# EasyEDA Pro project 2.4G遥控器.epro

# Schematic Schematic1
Board Name: Board1; Create Date: 2024-08-30
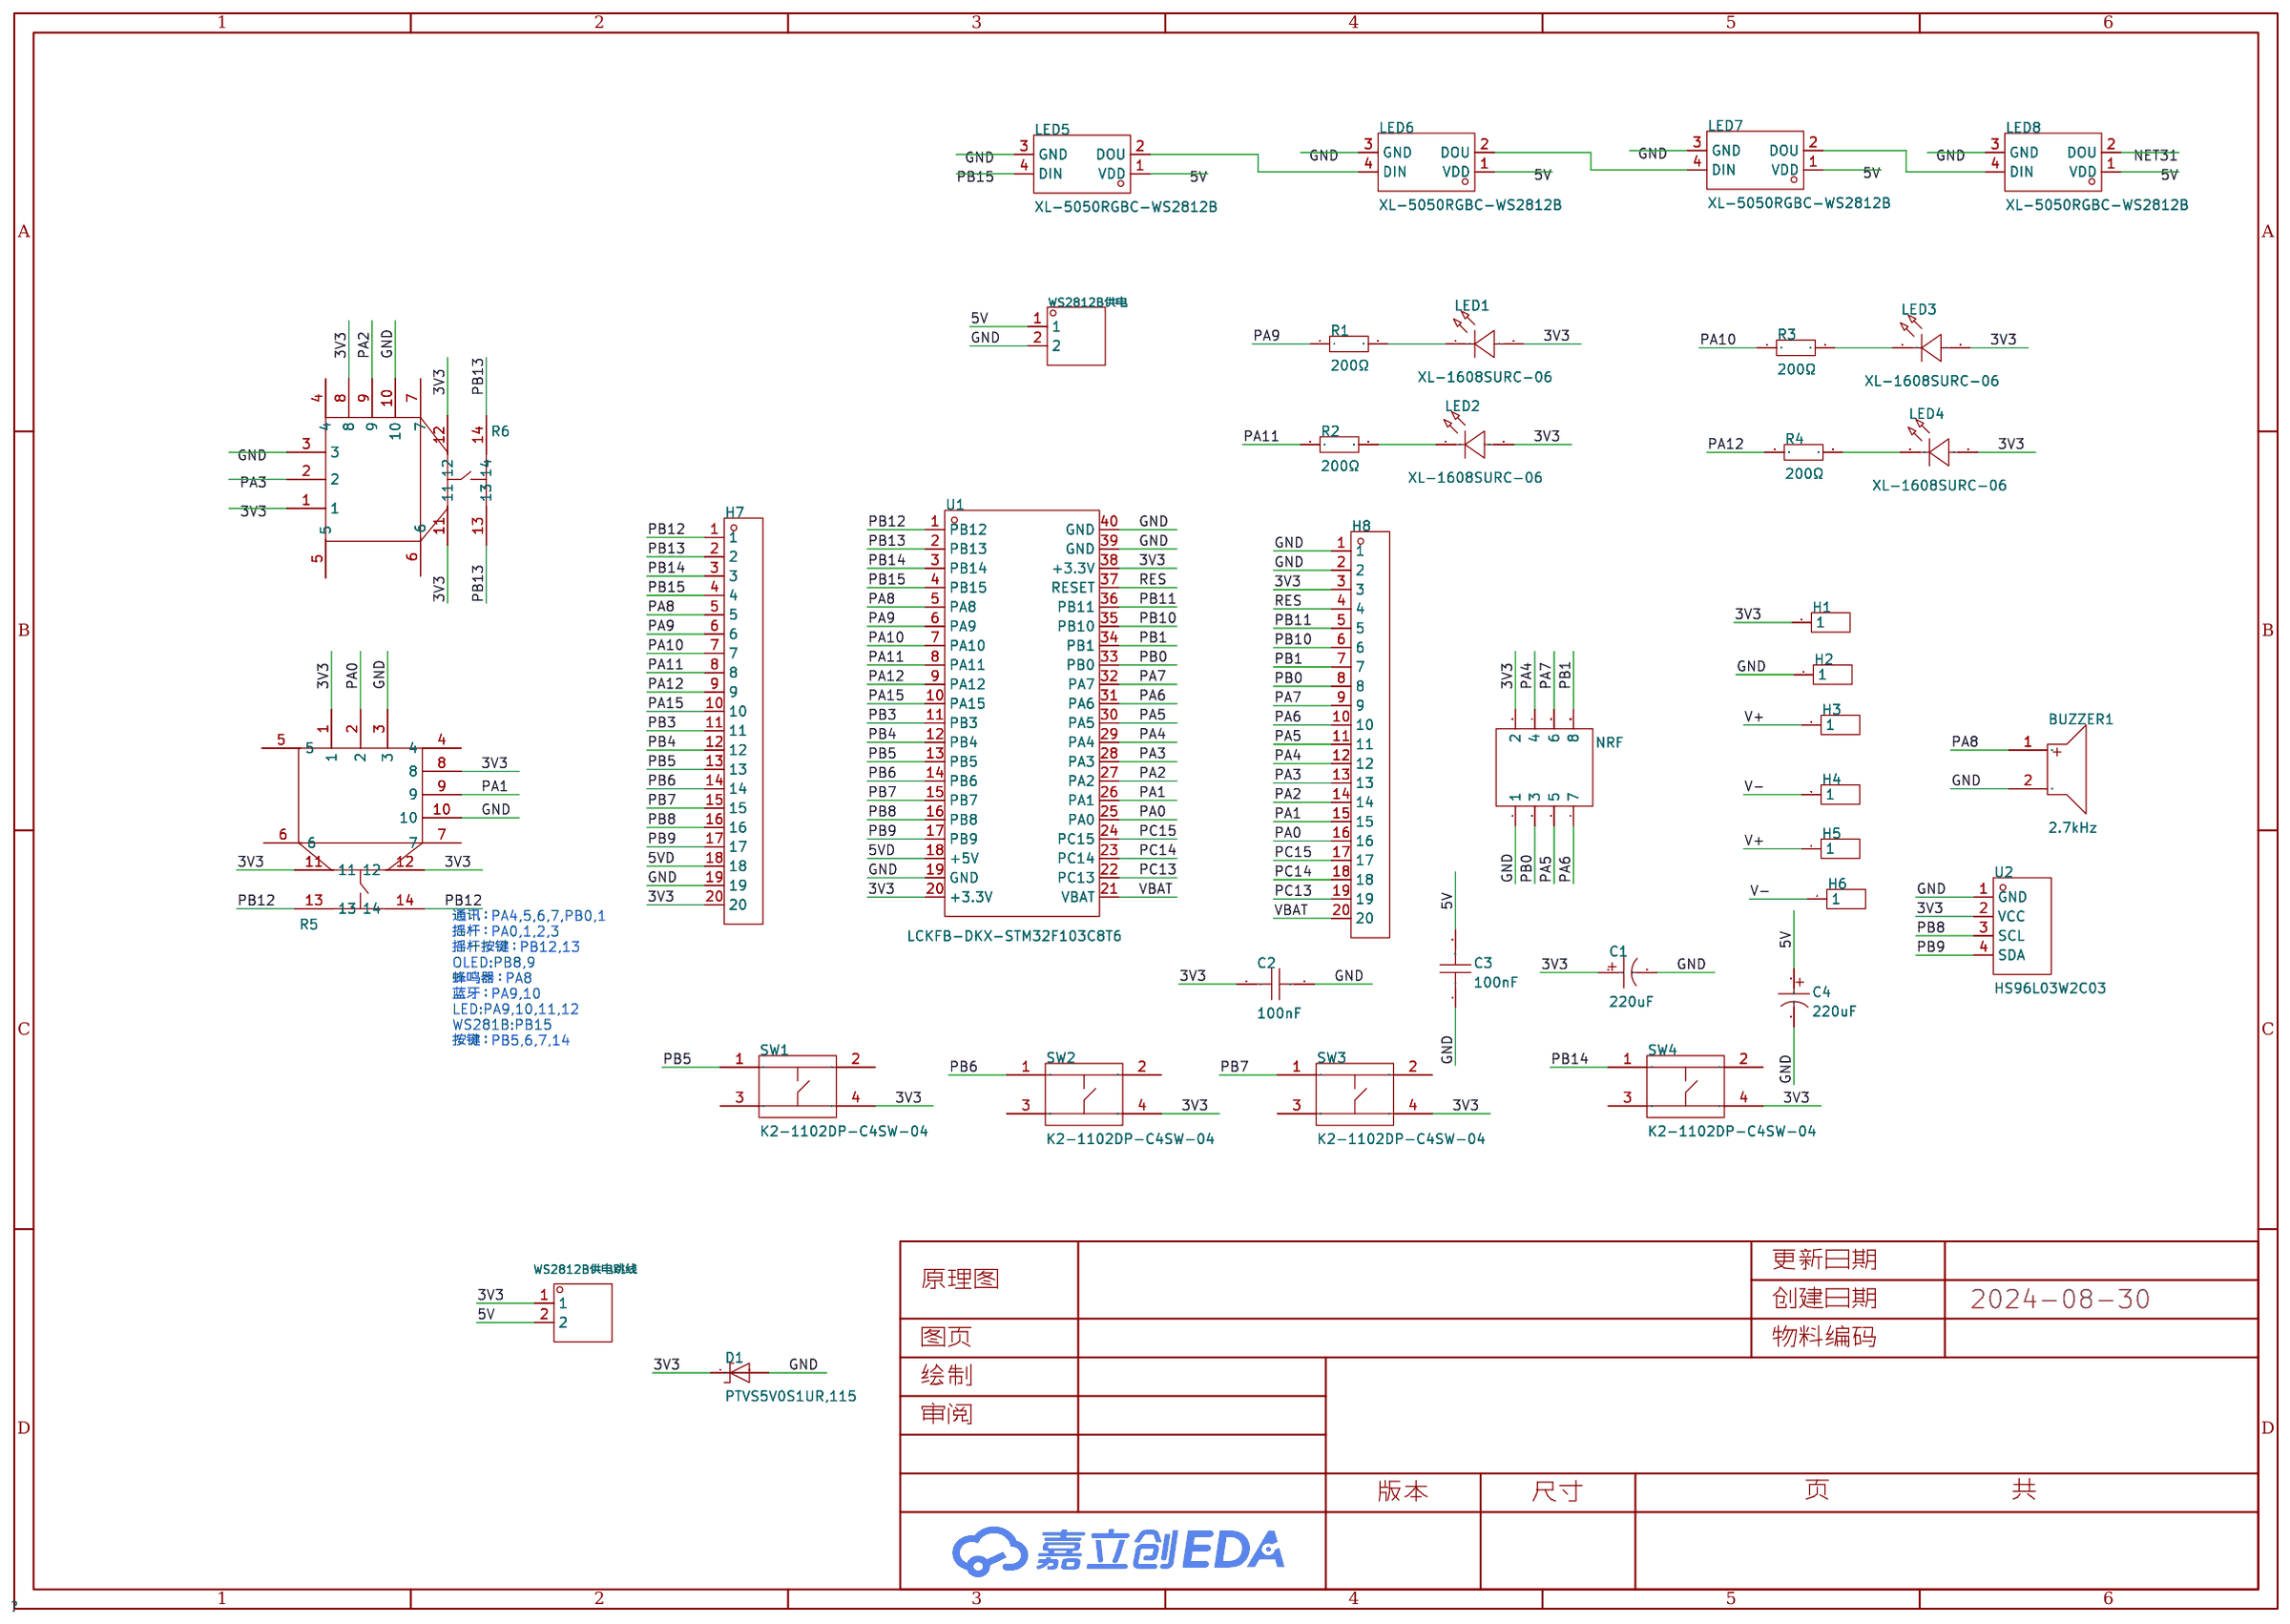
[diagram p0: schematic sheet]

## Parts
BUZZER1  2.7kHz  [BUZ-TH_BD9.0-P4.00-D0.6-FD]
C1  220uF  [CAP-TH_BD8.0-P3.50-D0.6-FD]
C2  100nF  [C0603]
C3  100nF  [C0603]
C4  220uF  [CAP-TH_BD8.0-P3.50-D0.6-FD]
D1  PTVS5V0S1UR,115  [SOD-123_L2.8-W1.8-LS3.7-RD]
H1  -  [HDR-TH_1P-V-M_XKB_X4611WV-01I-C28D40]
H2  -  [HDR-TH_1P-V-M_XKB_X4611WV-01I-C28D40]
H3  -  [HDR-TH_1P-V-M_XKB_X4611WV-01I-C28D40]
H4  -  [HDR-TH_1P-V-M_XKB_X4611WV-01I-C28D40]
H5  -  [HDR-TH_1P-V-M_XKB_X4611WV-01I-C28D40]
H6  -  [HDR-TH_1P-V-M_XKB_X4611WV-01I-C28D40]
H7  -  [HDR-TH_20P-P2.54-V-M-1]
H8  -  [HDR-TH_20P-P2.54-V-M-1]
LED1  XL-1608SURC-06  [LED0603-RD_RED]
LED2  XL-1608SURC-06  [LED0603-RD_RED]
LED3  XL-1608SURC-06  [LED0603-RD_RED]
LED4  XL-1608SURC-06  [LED0603-RD_RED]
LED5  XL-5050RGBC-WS2812B  [LED-SMD_4P-L5.0-W5.0-BL_XL-5050RGBC]
LED6  XL-5050RGBC-WS2812B  [LED-SMD_4P-L5.0-W5.0-BL_XL-5050RGBC]
LED7  XL-5050RGBC-WS2812B  [LED-SMD_4P-L5.0-W5.0-BL_XL-5050RGBC]
LED8  XL-5050RGBC-WS2812B  [LED-SMD_4P-L5.0-W5.0-BL_XL-5050RGBC]
NRF  -  [HDR-TH_8P-P2.54-V-F-R2-C4-S2.54-1]
R1  200Ω  [R0603]
R2  200Ω  [R0603]
R3  200Ω  [R0603]
R4  200Ω  [R0603]
R5  -  [摇杆]
R6  -  [摇杆]
SW1  K2-1102DP-C4SW-04  [KEY-TH_4P-L6.0-W6.0-P4.50-LS6.50]
SW2  K2-1102DP-C4SW-04  [KEY-TH_4P-L6.0-W6.0-P4.50-LS6.50]
SW3  K2-1102DP-C4SW-04  [KEY-TH_4P-L6.0-W6.0-P4.50-LS6.50]
SW4  K2-1102DP-C4SW-04  [KEY-TH_4P-L6.0-W6.0-P4.50-LS6.50]
U1  LCKFB-DKX-STM32F103C8T6  [CONN-TH_L53.3-W22.9_STM32F103C8T6-CARD]
U2  HS96L03W2C03  [OLED-TH_L27.8-W27.2-P2.54_C9900033791]
WS2812B供电  -  [HDR-TH_2P-P2.54-V-M-1]
WS2812B供电跳线  -  [HDR-TH_2P-P2.54-V-M-1]

## Library data of the parts
BUZZER1 = QMB-09B-03: 驱动方式:无源(外部驱动);构造类型:电磁式;频率:2.7kHz;声压(SPL):85dB@3V,10cm;; LCSC Part Name: 无源蜂鸣器QMB-09B-03; Supplier Part: C96256; Manufacturer: 华能; Supplier Footprint: 插件,D=9mm; JLCPCB Part Class: 扩展库; Datasheet: https://atta.szlcsc.com/upload/public/pdf/source/20210401/C96256_958B17753B5AD7CBFBCFFC7C095B4484.pdf; Supplier: LCSC; Oscillator Circuit: 无源(外部驱动); Technology Type: 电磁式; Operating Voltage: 2V~5V; Sound Pressure Level (SPL): 85dB@3V,10cm; Diameter (φD): 9mm; Height: 5.7mm
C1 C4 = ERS1VM221F12OT: 容值:220uF;精度:±20%;额定电压:35V;; LCSC Part Name: 220uF ±20% 35V; Supplier Part: C106697; Manufacturer: AISHI(艾华集团); Supplier Footprint: 插件,D8xL12mm; JLCPCB Part Class: 扩展库; Datasheet: https://atta.szlcsc.com/upload/public/pdf/source/20191015/C438940_4B8E60A742BB0AE40DDEF87A5C89089D.pdf; Supplier: LCSC; Tolerance: ±20%; Rated Voltage: 35V; Lead Spacing: 3.5mm; φD: 8mm; L: 12mm; Lifetime @ Temp: 7000hrs@105℃
C2 C3 = CGA0603X7R104K500JT: 容值:100nF;精度:±10%;额定电压:50V;材质(温度系数):X7R;; LCSC Part Name: 100nF ±10% 50V; Supplier Part: C6119867; Manufacturer: HRE(芯声); Supplier Footprint: 0603; JLCPCB Part Class: Extended Part; Supplier: LCSC; Tolerance: ±10%; Voltage Rated: 50V; Temperature Coefficient: X7R
D1 = PTVS5V0S1UR,115: 极性:单向;反向截止电压(Vrwm):5V;击穿电压(最小值):6.4V;峰值脉冲电流(Ipp)@10/1000μs:43.5A;最大钳位电压:9.2V;; LCSC Part Name: 单向 5V; Supplier Part: C478011; Manufacturer: Nexperia(安世); Supplier Footprint: SOD-123W; JLCPCB Part Class: Extended Part; Datasheet: https://atta.szlcsc.com/upload/public/pdf/source/20200102/C478011_F05D9968189F983388C839BB3EF367D6.pdf; Supplier: LCSC; Polarity: 单向; Reverse Stand-Off Voltage (Vrwm): 5V; Breakdown Voltage (Min): 6.4V; Peak Pulse Current (Ipp)@10/1000μs: 43.5A; Maximum Clamping Voltage: 9.2V
H1-H6 = HDR-M_2.54_1x1P: Supplier Part: C81276; Supplier Footprint: 插件; JLCPCB Part Class: Extended Part
H7 H8 = HDR-M_2.54_1x20P: 间距:2.54mm;总PIN位数:20;排数:1;插针结构:-;行距:-;安装类型:直插;圆针/方针:-;额定电流:-;额定电压:-;配合针长度:-;塑高:-;触头材质:黄铜;触头镀层:-;颜色:黑色;; Supplier Part: C50981; Supplier Footprint: 插件
LED1-LED4 = XL-1608SURC-06: 发光颜色:红色;功率:55mW;正向电流:25mA;主波长:617nm~621nm;透镜颜色:无色透明透镜;色温:-;发光角度:120°;载带方式:正贴;工作温度:-30℃~+85℃;; Supplier Part: C965799; Manufacturer: XINGLIGHT(成兴光); Supplier Footprint: 0603; JLCPCB Part Class: 扩展库; Datasheet: https://atta.szlcsc.com/upload/public/pdf/source/20221102/D860AFDD1CDB02C5A8064103A32707E2.pdf; Supplier: LCSC; Emitted Color: 红色; Power Dissipation: 55mW; Forward Current: 25mA; Dominant Wavelength: 617nm~621nm; Peak Wavelength: 623nm; Lens Color: 无色透明透镜; Viewing Angle: 120°; Mounting Sytle: 正贴; Operating Temperature: -30℃~+85℃
LED5-LED8 = XL-5050RGBC-WS2812B: 5050七彩幻彩透明贴片LED灯珠 5050 幻彩透明四脚 ws2812B 内置驱动IC; Supplier Part: C2843785; Manufacturer: XINGLIGHT(成兴光); Supplier Footprint: SMD5050; JLCPCB Part Class: 扩展库; Datasheet: https://atta.szlcsc.com/upload/public/pdf/source/20240412/E1004CAA80592E31D08BFE019083806F.pdf; Supplier: LCSC
NRF = HDR-F_2.54_2x4: Supplier Part: C92271; Supplier Footprint: 插件
R1-R4 = 0603WAF1002T5E: 电阻类型:厚膜电阻;阻值:10kΩ;精度:±1%;功率:100mW;最大工作电压:75V;温度系数:±100ppm/℃;; LCSC Part Name: 厚膜电阻 10kΩ ±1% 100mW; Supplier Part: C25804; Manufacturer: UNI-ROYAL(厚声); Supplier Footprint: 0603; JLCPCB Part Class: 基础库; Datasheet: https://atta.szlcsc.com/upload/public/pdf/source/20200306/C422600_1E6D84923E4A46A82E41ADD87F860B5C.pdf; Supplier: LCSC; Type: 厚膜电阻; Tolerance: ±1%; Power(Watts): 100mW; Overload Voltage (Max): 75V; Temperature Coefficient: ±100ppm/℃; Operating Temperature Range: -55℃~+155℃
R5 R6 = 摇杆
SW1-SW4 = K2-1102DP-C4SW-04: 电路结构:单刀单掷;按钮形状:圆形按钮;作用力:2.5N;安装方式:直插;开关长度:6mm;开关宽度:6mm;开关高度:5mm;触点电流:50mA;额定电压(DC):12V;绝缘电阻:100MΩ;带灯:-;机械寿命:10万次;; LCSC Part Name: 轻触按键开关6*6*5; Supplier Part: C110153; Manufacturer: 韩国韩荣; Supplier Footprint: 插件; JLCPCB Part Class: 扩展库; Datasheet: https://atta.szlcsc.com/upload/public/pdf/source/20210810/D0CD9D77408EACA829A5E533AC6E5B1E.pdf; Supplier: LCSC; Circuit: 单刀单掷; Actuator Style: 圆形按钮; Operating Force: 2.5N; Mounting Style: 直插; Switch Length: 6mm; Switch Width: 6mm; Switch Height: 5mm; Contact Current: 50mA; Voltage Rating (DC): 12V; Insulation Resistance: 100MΩ; Mechanical Life: 10万次; Operating Temperature: -25℃~+85℃
U1 = LCKFB-DKX-STM32F103C8T6: LCSC Part Name: 立创·地阔星-STM32F103C8T6开发板; Supplier Part: C22396880; Manufacturer: 立创开发板; Datasheet: https://atta.szlcsc.com/upload/public/pdf/source/20240801/7EEF69F7480DF7C6DA98696664D658D4.pdf; Supplier: LCSC
U2 = HS96L03W2C03: 主控芯片:SSD1315;接口类型:I2C;尺寸(inch):0.96;像素分辨率:128x64;; LCSC Part Name: 0.96寸OLED显示屏窄白光IIC; Supplier Part: C5248080; Manufacturer: HS(汉昇); JLCPCB Part Class: 扩展库; Datasheet: https://atta.szlcsc.com/upload/public/pdf/source/20230627/763D01F79A90007632F098068C7C8AD9.pdf; Supplier: LCSC; Main Control Chip: SSD1315; Interface Type: I2C; Size: 0.96; Pixel Resolution: 128x64; Operating Temperature: -40℃~+70℃
WS2812B供电 WS2812B供电跳线 = HDR-M_2.54_1x2P: Supplier Part: C124375; Supplier Footprint: 插件

## Nets
3V3: C1.1 C2.1 D1.1(C) H1.1 H7.20 H8.3 LED1.2(A) LED2.2(A) LED3.2(A) LED4.2(A) NRF.2 R5.1 R5.8 R5.11 R5.12 R6.1 R6.8 R6.11 R6.12 SW1.4 SW2.4 SW3.4 SW4.4 U1.20(+3.3V) U1.38(+3.3V) U2.2(VCC) WS2812B供电跳线.1
5V: C3.2 C4.1 LED5.1(VDD) LED6.1(VDD) LED7.1(VDD) LED8.1(VDD) WS2812B供电.1 WS2812B供电跳线.2
5VD: H7.18 U1.18(+5V)
GND: BUZZER1.2 C1.2 C2.2 C3.1 C4.2 D1.2(A) H2.1 H7.19 H8.1 H8.2 LED5.3(GND) LED6.3(GND) LED7.3(GND) LED8.3(GND) NRF.1 R5.3 R5.10 R6.3 R6.10 U1.19(GND) U1.39(GND) U1.40(GND) U2.1(GND) WS2812B供电.2
VBAT: H8.20 U1.21(VBAT)
NET31: LED8.2(DOU)
PA0: H8.16 R5.2 U1.25(PA0)
PA1: H8.15 R5.9 U1.26(PA1)
PA2: H8.14 R6.9 U1.27(PA2)
PA3: H8.13 R6.2 U1.28(PA3)
PA4: H8.12 NRF.4 U1.29(PA4)
PA5: H8.11 NRF.5 U1.30(PA5)
PA6: H8.10 NRF.7 U1.31(PA6)
PA7: H8.9 NRF.6 U1.32(PA7)
PA8: BUZZER1.1 H7.5 U1.5(PA8)
PA9: H7.6 R1.1 U1.6(PA9)
PA10: H7.7 R3.1 U1.7(PA10)
PA11: H7.8 R2.1 U1.8(PA11)
PA12: H7.9 R4.1 U1.9(PA12)
PA15: H7.10 U1.10(PA15)
PB0: H8.8 NRF.3 U1.33(PB0)
PB1: H8.7 NRF.8 U1.34(PB1)
PB3: H7.11 U1.11(PB3)
PB4: H7.12 U1.12(PB4)
PB5: H7.13 SW1.1 U1.13(PB5)
PB6: H7.14 SW2.1 U1.14(PB6)
PB7: H7.15 SW3.1 U1.15(PB7)
PB8: H7.16 U1.16(PB8) U2.3(SCL)
PB9: H7.17 U1.17(PB9) U2.4(SDA)
PB10: H8.6 U1.35(PB10)
PB11: H8.5 U1.36(PB11)
PB12: H7.1 R5.13 R5.14 U1.1(PB12)
PB13: H7.2 R6.13 R6.14 U1.2(PB13)
PB14: H7.3 SW4.1 U1.3(PB14)
PB15: H7.4 LED5.4(DIN) U1.4(PB15)
PC13: H8.19 U1.22(PC13)
PC14: H8.18 U1.23(PC14)
PC15: H8.17 U1.24(PC15)
RES: H8.4 U1.37(RESET)
V+: H3.1 H5.1
V-: H4.1 H6.1
$1N3608: LED5.2(DOU) LED6.4(DIN)
$1N3616: LED6.2(DOU) LED7.4(DIN)
$1N3624: LED7.2(DOU) LED8.4(DIN)
Net-(LED1-1): LED1.1(K) R1.2
Net-(LED2-1): LED2.1(K) R2.2
Net-(LED3-1): LED3.1(K) R3.2
Net-(LED4-1): LED4.1(K) R4.2

Not connected (* = marked no-connect by the designer): R5 4 5 6 7; R6 4 5 6 7; SW1 2 3; SW2 2 3; SW3 2 3; SW4 2 3

## Notes on the sheet
- 通讯：PA4,5,6,7,PB0,1
  摇杆：PA0,1,2,3
  摇杆按键：PB12,13
  OLED:PB8,9
  蜂鸣器：PA8
  蓝牙：PA9,10
  LED:PA9,10,11,12
  WS281B:PB15
  按键：PB5,6,7,14

# Board PCB1
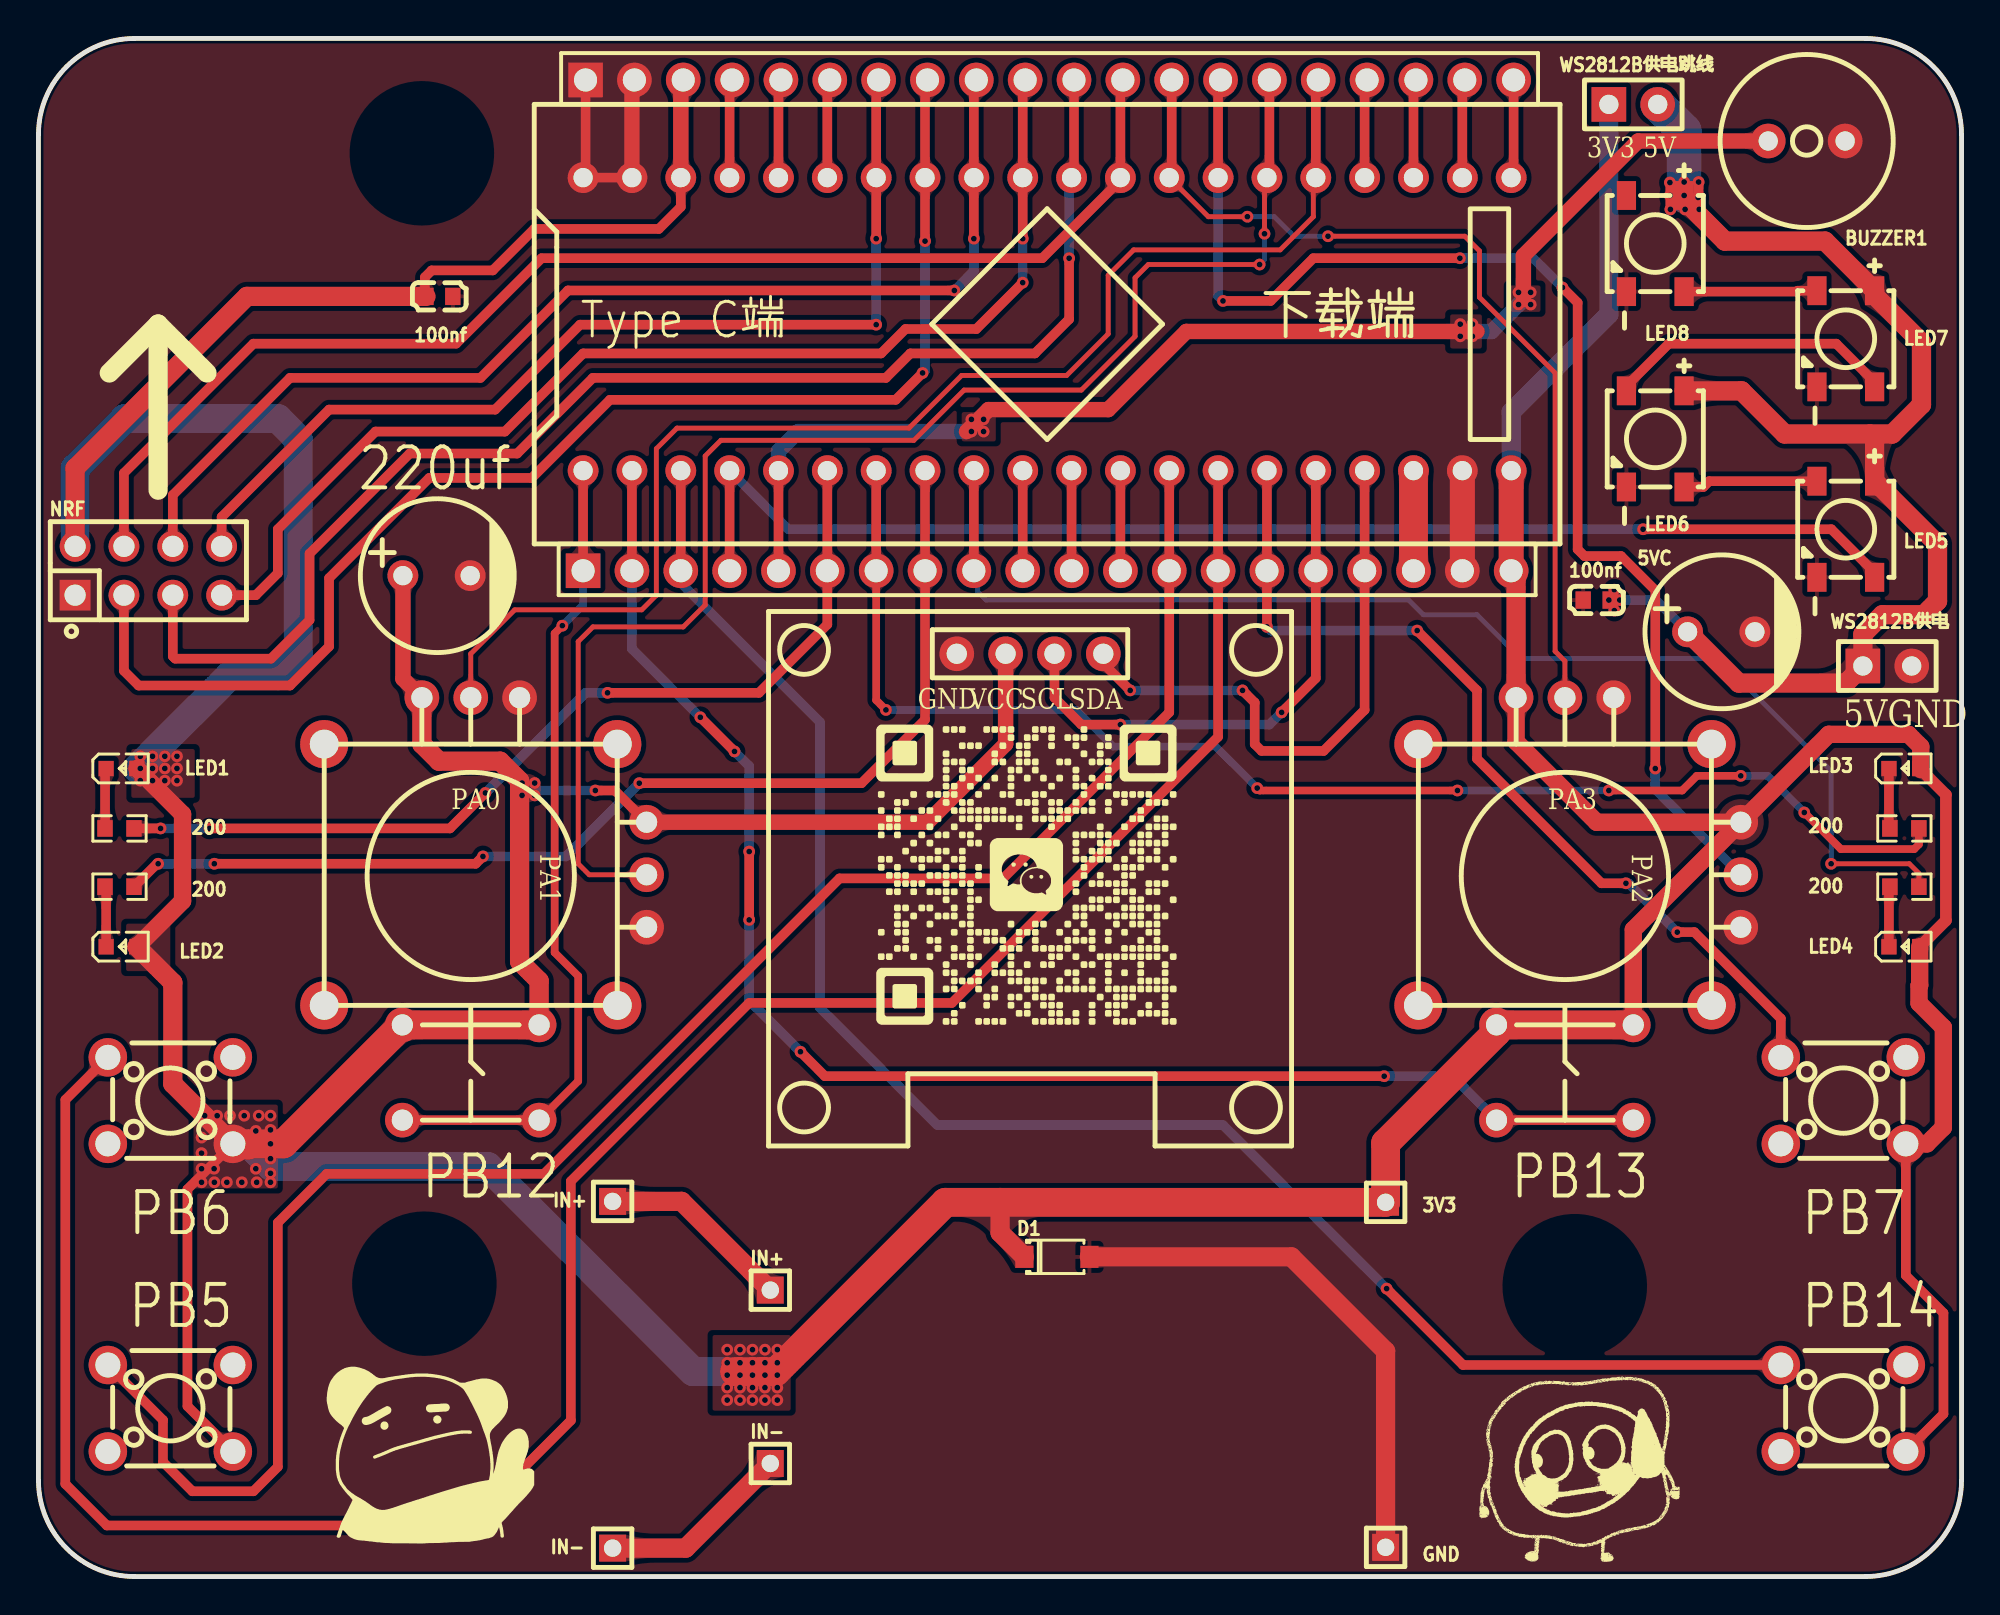
[diagram p1: board, top side]
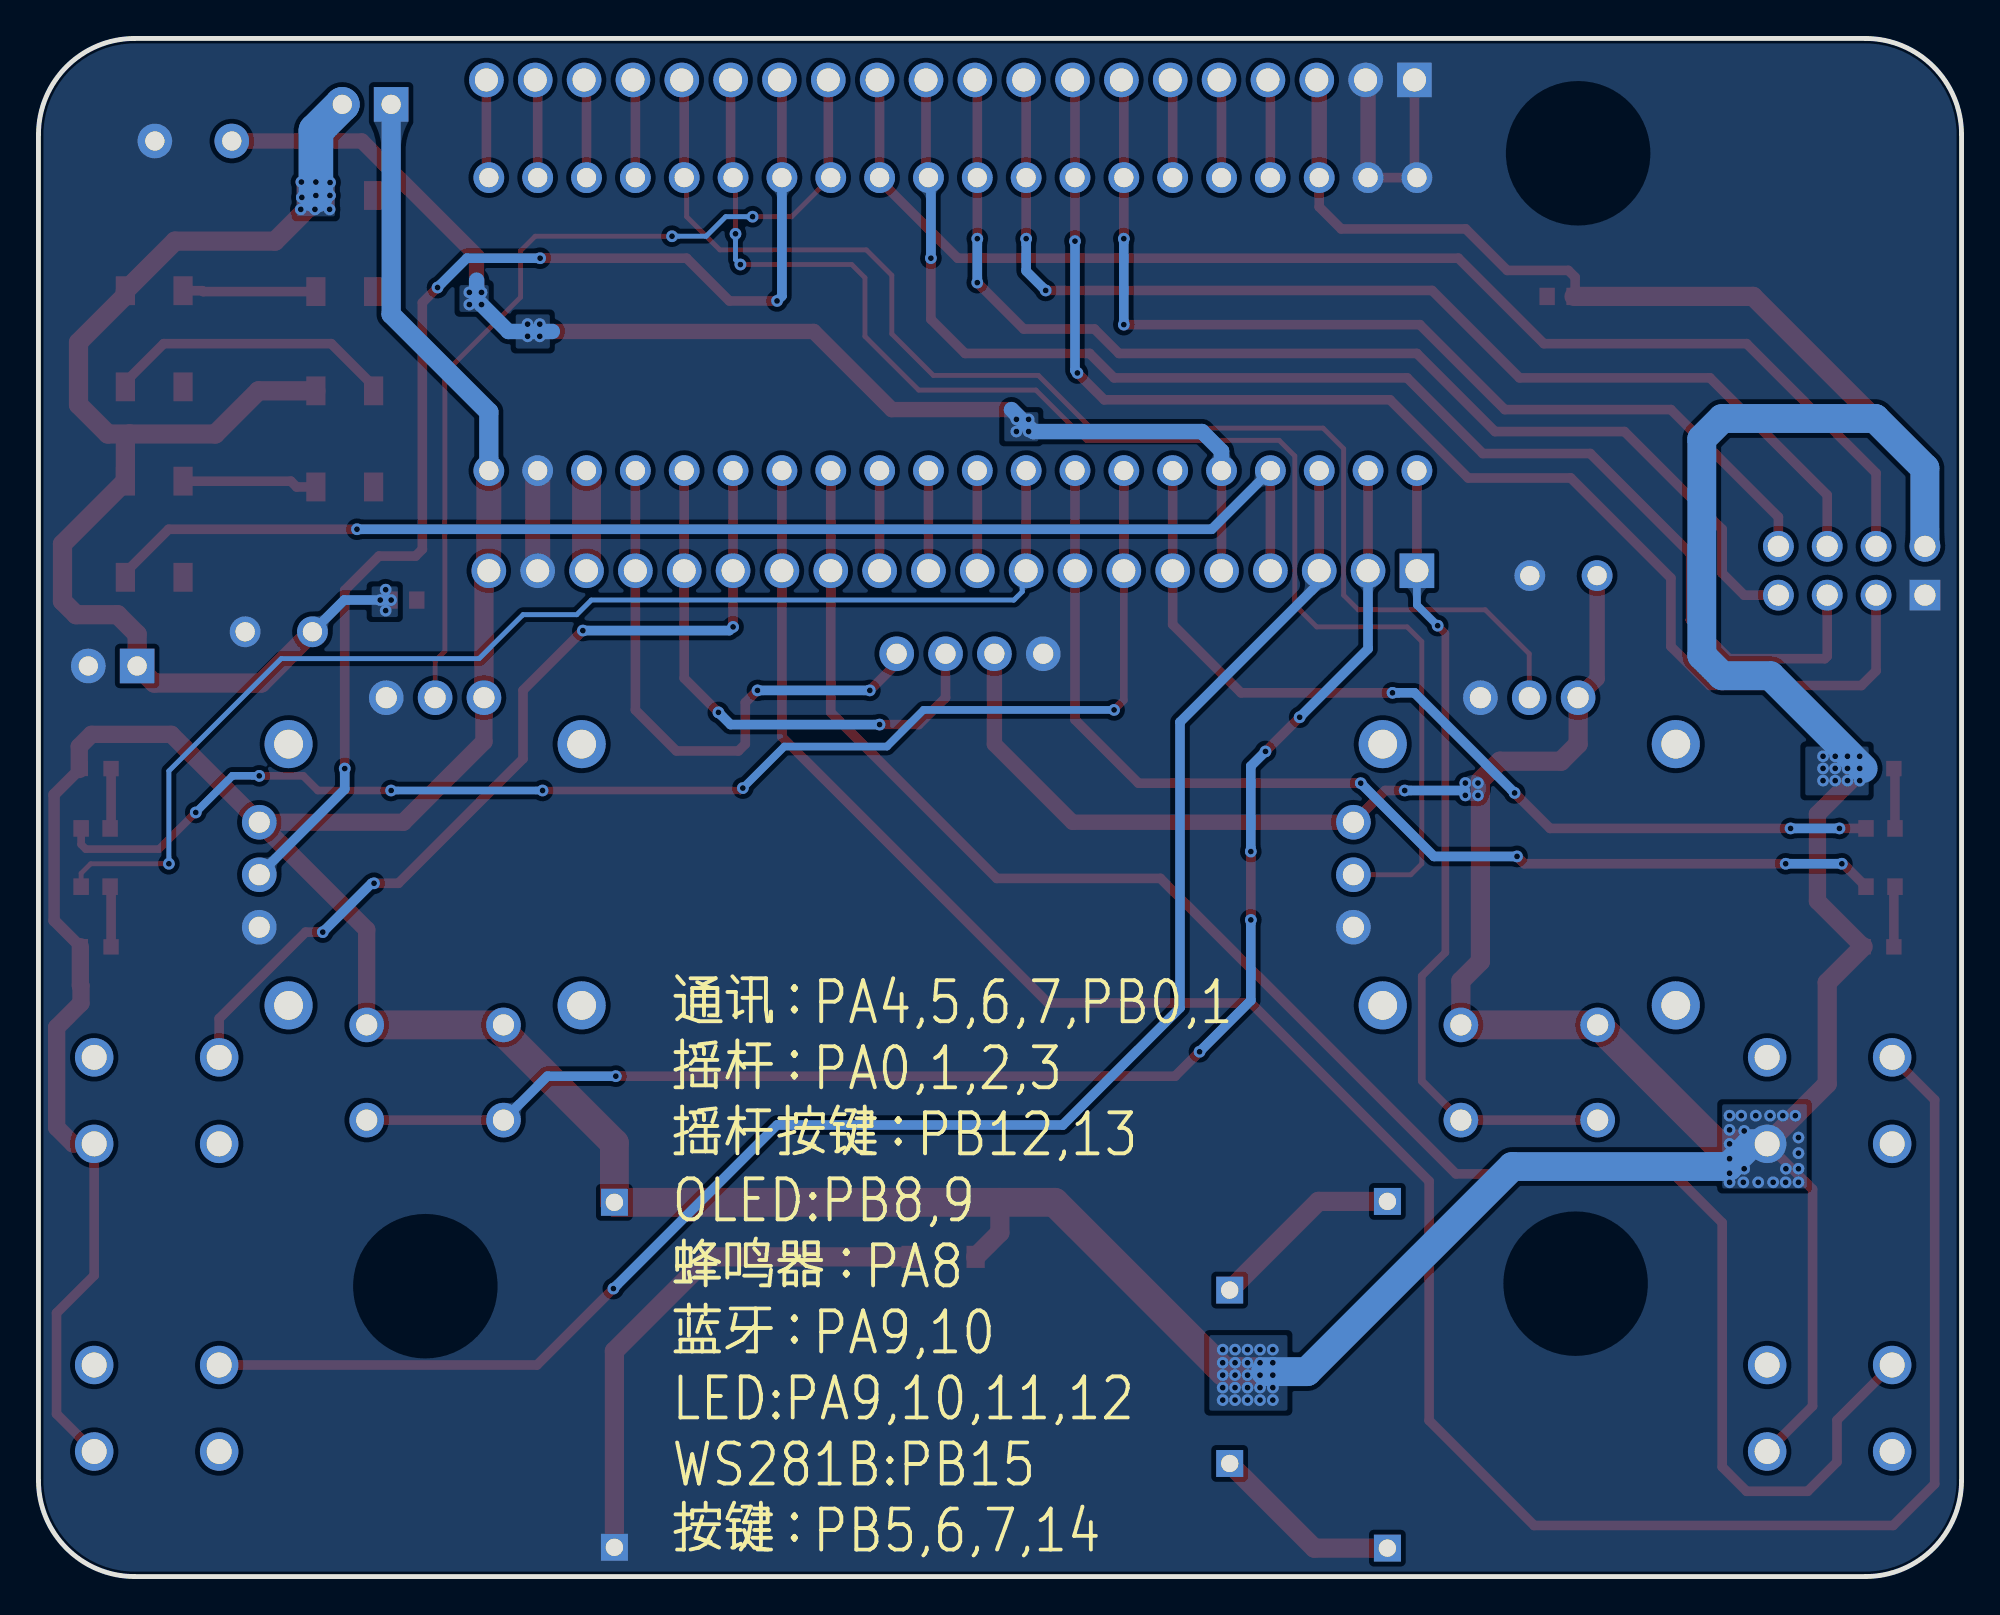
[diagram p2: board, bottom side, seen from below]

Outline 100 x 80 mm; copper layers: Top Layer, Bottom Layer. Coordinates in mm from the lower left corner of the outline.
Outline path: 0,75 0,5 arc(1.46,1.46) 5,0 95,0 arc(98.54,1.46) 100,5 100,75 arc(98.54,78.54) 95,80 5,80 arc(1.46,78.54) 0,75
Stack: Top Layer 0.035mm / Dielectric1 1.51mm FR4 er 4.5 / Bottom Layer 0.035mm

## Design rules (mm)
template: 自定义配置
spacing copperThickness1oz (default): track to track 0.3, other pairs 0.152 to 0.3
spacing copperThickness2oz: track to track 0.203, other pairs 0.152 to 0.3
track width copperThickness1oz (default): min 0.127, default 0.5, max 2.54
track width copperThickness2oz: min 0.203, default 0.254, max 2.54
differential pair differentialPair (default): width min 0.127, default 0.254, max 2.54; gap min 0.152, default 0.152
via viaSize (default): diameter min 0.5, default 0.61, max 10; hole min 0.3, default 0.305, max 6.3
net $1N3383 uses copperRegion1

## Placement (name value [footprint] x y rotation side)
3V3  -  [HDR-TH_1P-V-M_XKB_X4611WV-01I-C28D40]  70.05 19.46 270 top
5VC  220uF  [CAP-TH_BD8.0-P3.50-D0.6-FD]  87.5 49.14 0 top
100nf  -  [C0603]  20.85 66.58 0 top
100nf#2  -  [C0603]  81.03 50.79 0 top
200  -  [R0603]  4.21 38.91 180 top
200#2  -  [R0603]  4.21 35.88 180 top
200#3  -  [R0603]  97.03 38.91 180 top
200#4  -  [R0603]  97.03 35.88 180 top
BUZZER1  2.7kHz  [BUZ-TH_BD9.0-P4.00-D0.6-FD]  91.95 74.67 0 top
C1  220uF  [CAP-TH_BD8.0-P3.50-D0.6-FD]  20.7 52.06 0 top
D1  PTVS5V0S1UR,115  [SOD-123_L2.8-W1.8-LS3.7-RD]  52.96 16.63 0 top
GND  -  [HDR-TH_1P-V-M_XKB_X4611WV-01I-C28D40]  70.05 1.52 270 top
H7  -  [HDR-TH_20P-P2.54-V-M-1]  52.45 52.31 0 top
H8  -  [HDR-TH_20P-P2.54-V-M-1]  52.58 77.84 0 top
IN+  -  [HDR-TH_1P-V-M_XKB_X4611WV-01I-C28D40]  29.86 19.51 270 top
IN+#2  -  [HDR-TH_1P-V-M_XKB_X4611WV-01I-C28D40]  38.06 14.9 0 top
IN-  -  [HDR-TH_1P-V-M_XKB_X4611WV-01I-C28D40]  38.06 5.88 0 top
IN-#2  -  [HDR-TH_1P-V-M_XKB_X4611WV-01I-C28D40]  29.86 1.48 270 top
LED1  XL-1608SURC-06  [LED0603-RD_RED]  4.32 42.03 0 top
LED2  XL-1608SURC-06  [LED0603-RD_RED]  4.32 32.76 0 top
LED3  XL-1608SURC-06  [LED0603-RD_RED]  97.02 42.03 0 top
LED4  XL-1608SURC-06  [LED0603-RD_RED]  97.02 32.76 0 top
LED5  XL-5050RGBC-WS2812B  [LED-SMD_4P-L5.0-W5.0-BL_XL-5050RGBC]  93.98 54.47 180 top
LED6  XL-5050RGBC-WS2812B  [LED-SMD_4P-L5.0-W5.0-BL_XL-5050RGBC]  84.07 59.17 180 top
LED7  XL-5050RGBC-WS2812B  [LED-SMD_4P-L5.0-W5.0-BL_XL-5050RGBC]  93.98 64.38 180 top
LED8  XL-5050RGBC-WS2812B  [LED-SMD_4P-L5.0-W5.0-BL_XL-5050RGBC]  84.07 69.33 180 top
NRF  -  [HDR-TH_8P-P2.54-V-F-R2-C4-S2.54-1]  5.72 52.31 0 top
R5  -  [摇杆]  22.35 36.69 0 top
R6  -  [摇杆]  79.25 36.69 0 top
SW1  K2-1102DP-C4SW-04  [KEY-TH_4P-L6.0-W6.0-P4.50-LS6.50]  6.86 8.75 0 top
SW2  K2-1102DP-C4SW-04  [KEY-TH_4P-L6.0-W6.0-P4.50-LS6.50]  6.86 24.75 0 top
SW3  K2-1102DP-C4SW-04  [KEY-TH_4P-L6.0-W6.0-P4.50-LS6.50]  93.85 24.75 0 top
SW4  K2-1102DP-C4SW-04  [KEY-TH_4P-L6.0-W6.0-P4.50-LS6.50]  93.85 8.75 0 top
Type C端  LCKFB-DKX-STM32F103C8T6  [CONN-TH_L53.3-W22.9_STM32F103C8T6-CARD]  52.45 65.14 0 top
U2  HS96L03W2C03  [OLED-TH_L27.8-W27.2-P2.54_C9900033791]  51.56 48 0 top
WS2812B供电  -  [HDR-TH_2P-P2.54-V-M-1]  96.14 47.36 0 top
WS2812B供电跳线  -  [HDR-TH_2P-P2.54-V-M-1]  82.93 76.57 0 top

## Footprints (pads in the part's own frame, mm; a bottom-side part is the same pattern mirrored in y, then rotated)
BUZ-TH_BD9.0-P4.00-D0.6-FD
  round 1.8 hole 1: 1(-2,0) 2(2,0)
C0603
  rect 0.8x0.9 smd: 1(-0.7,0) 2(0.7,0)
CAP-TH_BD8.0-P3.50-D0.6-FD
  round 1.6 hole 1: 1(-1.75,0) 2(1.75,0)
CONN-TH_L53.3-W22.9_STM32F103C8T6-CARD
  round 1.6 hole 1: 1(-24.13,-7.62) 2(-21.59,-7.62) 3(-19.05,-7.62) 4(-16.51,-7.62) 5(-13.97,-7.62) 6(-11.43,-7.62) 7(-8.89,-7.62) 8(-6.35,-7.62) 9(-3.81,-7.62) 10(-1.27,-7.62) 11(1.27,-7.62) 12(3.81,-7.62) 13(6.35,-7.62) 14(8.89,-7.62) 15(11.43,-7.62) 16(13.97,-7.62) 17(16.51,-7.62) 18(19.05,-7.62) 19(21.59,-7.62) 20(24.13,-7.62) 21(24.13,7.62) 22(21.59,7.62) 23(19.05,7.62) 24(16.51,7.62) 25(13.97,7.62) 26(11.43,7.62) 27(8.89,7.62) 28(6.35,7.62) 29(3.81,7.62) 30(1.27,7.62) 31(-1.27,7.62) 32(-3.81,7.62) 33(-6.35,7.62) 34(-8.89,7.62) 35(-11.43,7.62) 36(-13.97,7.62) 37(-16.51,7.62) 38(-19.05,7.62) 39(-21.59,7.62) 40(-24.13,7.62)
HDR-TH_1P-V-M_XKB_X4611WV-01I-C28D40
  rect 1.4x1.4 hole 0.9: 1(0,0)
HDR-TH_2P-P2.54-V-M-1
  rect 1.8x1.8 hole 1: 1(-1.27,0)
  round 1.8 hole 1: 2(1.27,0)
HDR-TH_8P-P2.54-V-F-R2-C4-S2.54-1
  rect 1.6x1.6 hole 1.1: 1(-3.81,-1.27)
  round 1.6 hole 1.1: 2(-3.81,1.27) 3(-1.27,-1.27) 4(-1.27,1.27) 5(1.27,-1.27) 6(1.27,1.27) 7(3.81,-1.27) 8(3.81,1.27)
HDR-TH_20P-P2.54-V-M-1
  rect 1.8x1.8 hole 1.2: 1(-24.13,0)
  round 1.8 hole 1.2: 2(-21.59,0) 3(-19.05,0) 4(-16.51,0) 5(-13.97,0) 6(-11.43,0) 7(-8.89,0) 8(-6.35,0) 9(-3.81,0) 10(-1.27,0) 11(1.27,0) 12(3.81,0) 13(6.35,0) 14(8.89,0) 15(11.43,0) 16(13.97,0) 17(16.51,0) 18(19.05,0) 19(21.59,0) 20(24.13,0)
KEY-TH_4P-L6.0-W6.0-P4.50-LS6.50
  round 2 hole 1.3: 1(-3.25,2.25) 2(3.25,2.25) 3(-3.25,-2.25) 4(3.25,-2.25)
LED0603-RD_RED
  rect 0.8x0.8 smd: 1(-0.799,-0.004) 2(0.799,0.004)
LED-SMD_4P-L5.0-W5.0-BL_XL-5050RGBC
  rect 1x1.5 smd: 1(-1.5,-2.5) 2(1.5,-2.5) 3(1.5,2.5) 4(-1.5,2.5)
OLED-TH_L27.8-W27.2-P2.54_C9900033791
  round 1.8 hole 1.05: 1(-3.81,0) 2(-1.27,0) 3(1.27,0) 4(3.81,0)
R0603
  rect 0.806x0.864 smd: 1(-0.753,0) 2(0.753,0)
SOD-123_L2.8-W1.8-LS3.7-RD
  rect 0.95x1.15 smd: 1(-1.692,0) 2(1.692,0)
摇杆
  round 1.8 hole 1.1: 1(-2.413,9.017) 2(0.127,9.017) 3(2.667,9.017) 8(9.271,2.54) 9(9.271,-0.191) 10(9.271,-2.921) 11(-3.429,-8.001) 12(3.683,-8.001) 13(-3.429,-12.954) 14(3.683,-12.954)
  round 2.5 hole 1.5: 4(7.747,6.604) 5(-7.493,6.604) 6(-7.493,-6.985) 7(7.747,-6.985)

## Nets
3V3: 3V3.1 100nf.1 C1.1 D1.1 H7.20 H8.3 LED1.2 LED2.2 LED3.2 LED4.2 NRF.2 R5.1 R5.8 R5.11 R5.12 R6.1 R6.8 R6.11 R6.12 SW1.4 SW2.4 SW3.4 SW4.4 Type C端.20 Type C端.38 U2.2 WS2812B供电跳线.1
5V: 5VC.1 100nf#2.2 LED5.1 LED6.1 LED7.1 LED8.1 WS2812B供电.1 WS2812B供电跳线.2
5VD: H7.18 Type C端.18
GND: 5VC.2 100nf.2 100nf#2.1 BUZZER1.2 C1.2 D1.2 GND.1 H7.19 H8.1 H8.2 LED5.3 LED6.3 LED7.3 LED8.3 NRF.1 R5.3 R5.10 R6.3 R6.10 Type C端.19 Type C端.39 Type C端.40 U2.1 WS2812B供电.2
VBAT: H8.20 Type C端.21
NET31: LED8.2
PA0: H8.16 R5.2 Type C端.25
PA1: H8.15 R5.9 Type C端.26
PA2: H8.14 R6.9 Type C端.27
PA3: H8.13 R6.2 Type C端.28
PA4: H8.12 NRF.4 Type C端.29
PA5: H8.11 NRF.5 Type C端.30
PA6: H8.10 NRF.7 Type C端.31
PA7: H8.9 NRF.6 Type C端.32
PA8: BUZZER1.1 H7.5 Type C端.5
PA9: 200.1 H7.6 Type C端.6
PA10: 200#3.1 H7.7 Type C端.7
PA11: 200#2.1 H7.8 Type C端.8
PA12: 200#4.1 H7.9 Type C端.9
PA15: H7.10 Type C端.10
PB0: H8.8 NRF.3 Type C端.33
PB1: H8.7 NRF.8 Type C端.34
PB3: H7.11 Type C端.11
PB4: H7.12 Type C端.12
PB5: H7.13 SW1.1 Type C端.13
PB6: H7.14 SW2.1 Type C端.14
PB7: H7.15 SW3.1 Type C端.15
PB8: H7.16 Type C端.16 U2.3
PB9: H7.17 Type C端.17 U2.4
PB10: H8.6 Type C端.35
PB11: H8.5 Type C端.36
PB12: H7.1 R5.13 R5.14 Type C端.1
PB13: H7.2 R6.13 R6.14 Type C端.2
PB14: H7.3 SW4.1 Type C端.3
PB15: H7.4 LED5.4 Type C端.4
PC13: H8.19 Type C端.22
PC14: H8.18 Type C端.23
PC15: H8.17 Type C端.24
RES: H8.4 Type C端.37
V+: IN+.1 IN+#2.1
V-: IN-.1 IN-#2.1
$1N3007: 200.2 LED1.1
$1N3213: 200#2.2 LED2.1
$1N3298: 200#3.2 LED3.1
$1N3383: 200#4.2 LED4.1
$1N3608: LED5.2 LED6.4
$1N3616: LED6.2 LED7.4
$1N3624: LED7.2 LED8.4

Pads without a net: R5 4 5 6 7; R6 4 5 6 7; SW1 2 3; SW2 2 3; SW3 2 3; SW4 2 3

## Via types
v1: diameter 0.61, hole 0.305, Top Layer to Bottom Layer, 138 vias

## Routing (per net, layer and track width the routed paths; a pad name or vN(x,y) marks a point on that pad's centre or on a via; arc(x,y) is an arc through that point)
3V3: length 412
  Top Layer w0.5: SW2.4 7.75,20.14 7.75,8.86 SW1.4 ; 33.4,72.76 33.4,71.24 32.26,70.09 25.78,70.09 23.62,67.94 20.45,67.94 20.09,67.58 20.09,66.64 100nf.1 ; SW3.4 97.1,15.66 99.06,13.71 99.06,8.46 SW4.4 ; R5.8 29.97,40.88 v1(28.96,40.88)
  Top Layer w0.6: LED3.2 99.19,40.67 99.19,34.12 LED4.2
  Top Layer w0.8: C1.1 18.95,46.7 R5.1 ; 33.4,72.76 33.4,77.71 H8.3 ; U2.2 50.29,43.3 46.23,39.23 R5.8
  Top Layer w0.9: R6.8 82.93,33.64 82.93,28.69 ; R6.8 93.09,43.81 97.24,43.81 97.88,43.17 97.88,41.97 ; R6.8 81.03,39.23 76.84,43.42 76.84,45.71 ; LED1.2 7.49,39.66 7.49,35.14 LED2.2 ; LED4.2 97.82,30.76 97.79,30.72 97.79,29.82 99.05,28.56 99.05,23.36 98.2,22.5 SW3.4
  Top Layer w1: D1.1 50.01,17.89 50.01,19.46 ; H7.20 76.84,52.06 76.84,45.71 ; SW2.4 v1(8.64,23.97) 6.98,25.63 6.98,30.89 LED2.2 ; NRF.2 1.91,57.65 10.84,66.58 100nf.1 ; R5.1 19.94,43.3 20.83,42.41 24,42.41 25.02,41.39 25.02,31.99 26.03,30.98 R5.12
  Top Layer w1.3: H7.20 Type C端.20
  Top Layer w1.5: R5.12 R5.11 12.74,22.5 v1(12.06,22.5) 10.89,22.5 10.89,22.43 ; 82.93,28.69 R6.11 75.82,28.31 70.05,22.54 3V3.1 47.16,19.46 38.35,10.66 37.65,10.66 37.62,10.63 37.59,10.66 36.19,10.66
  Bottom Layer w0.5: v1(28.96,40.88) 25.8,40.88
  Bottom Layer w1: Type C端.20 76.58,60.57 81.66,65.65 WS2812B供电跳线.1
  Bottom Layer w1.5: LED1.2 9.94,46.85 12.45,46.85 13.51,47.91 13.51,59.17 12.45,60.23 4.49,60.23 1.91,57.65 NRF.2 ; 36.19,10.66 34.04,10.66 23.37,21.33 12.12,21.33 10.94,22.5 SW2.4
  vias: v1(5.3,42.67) v1(5.3,42.03) v1(5.3,41.4) v1(5.93,42.67) v1(5.93,42.03) v1(5.93,41.4) v1(6.57,42.67) v1(6.57,42.03) v1(6.57,41.4) v1(7.2,42.67) v1(7.2,42.03) v1(7.2,41.4) v1(8.48,22.83) v1(8.48,22.02) v1(8.48,21.21) v1(8.48,20.51) v1(9.13,21.21) v1(9.15,20.51) v1(9.29,23.97) v1(9.8,20.51) v1(9.96,23.97) v1(10.57,20.51) v1(10.7,23.97) v1(11.3,23.18) v1(11.3,21.21) v1(11.35,20.51) v1(11.46,23.97) v1(12.06,23.97) v1(12.06,23.23) v1(12.06,21.73) v1(12.06,20.98) v1(12.06,20.51) v1(25.15,41.27) v1(25.15,40.63) v1(25.8,41.27) v1(25.8,40.63) v1(35.81,11.8) v1(35.81,11.12) v1(35.81,10.48) v1(35.81,9.83) v1(35.81,9.18) v1(36.48,11.8) v1(36.48,11.12) v1(36.48,10.48) v1(36.48,9.83) v1(36.48,9.18) v1(37.13,11.8) v1(37.13,11.12) v1(37.13,10.48) v1(37.13,9.83) v1(37.13,9.18) v1(37.78,11.8) v1(37.78,11.12) v1(37.78,10.48) v1(37.78,9.83) v1(37.78,9.18) v1(38.42,11.8) v1(38.42,11.12) v1(38.42,10.48) v1(38.42,9.83) v1(38.42,9.18)
5V: length 72.9
  Top Layer w0.5: v1(86.36,71.11) 86.33,71.14 v1(86.33,72.53) ; v1(84.84,72.51) 84.86,72.48 v1(84.86,71.11)
  Top Layer w1: 95.25,59.43 90.81,59.43 88.56,61.67 LED6.1 ; 95.25,59.43 95.48,59.19 LED5.1 98.75,53.7 98.75,50.73 98.04,50.03 95.88,50.03 94.87,49.01 WS2812B供电.1 93.98,46.47 88.42,46.47 5VC.1 ; 95.25,59.43 96.39,59.43 97.92,60.95 97.92,64.19 95.48,66.63 LED7.1 92.9,69.46 87.7,69.46 85.57,71.58 v1(85.57,71.83)
  Bottom Layer w0.5: 5VC.1 84.1,50.79 v1(82.23,50.79) v1(81.66,50.79)
  Bottom Layer w1.8: v1(85.57,71.83) v1(85.57,72.53) 85.57,75.2 84.2,76.57
  vias: v1(81.94,51.33) v1(81.94,50.24) v1(84.84,71.83) v1(85.62,71.11) v1(86.3,71.73)
5VD: length 5.2
  Top Layer w1.5: Type C端.18 H7.18
GND: length 50.9
  Top Layer w0.5: H8.1 28.45,72.89 28.32,72.76 30.86,72.76 ; Type C端.19 H7.19
  Top Layer w0.8: 30.86,72.76 30.86,77.71 H8.2
  Top Layer w1: D1.2 65.15,16.63 70.05,11.73 GND.1
  Top Layer w1.3: H7.19 Type C端.19
VBAT: length 5.1
  Top Layer w0.5: 76.58,72.76 76.71,72.89 H8.20
PA0: length 69
  Top Layer w0.254: 66.42,72.76 66.29,72.63 66.29,70.73 64.57,69 56.95,69 55.63,67.68 55.63,64.63 53.47,62.47 48.01,62.47 45.26,59.73 33.2,59.73 32.13,58.66 32.13,51.04 31.37,50.28 24.77,50.28 22.48,48 R5.2
  Top Layer w0.5: H8.16 66.42,77.71 66.42,72.76
PA1: length 75
  Top Layer w0.254: v1(63.75,69.84) 63.75,72.63 63.88,72.76 ; v1(63.5,68.24) 57.71,68.24 57.02,67.55 57.02,64.51 54.23,61.71 48.13,61.71 45.52,59.1 35.49,59.1 34.67,58.28 34.67,50.54 33.53,49.39 28.83,49.39 28.07,48.63 28.07,37.07 28.64,36.5 R5.9
  Top Layer w0.5: 63.88,72.76 64.01,72.89 H8.15
  Bottom Layer w0.254: v1(63.5,68.24) 63.75,68.5 v1(63.75,69.84)
PA2: length 66.4
  Top Layer w0.5: H8.14 61.34,77.71 61.34,72.76 ; v1(73.91,68.57) 66.29,68.57 64.07,66.35 v1(61.59,66.35) ; v1(84.07,42.03) 84.07,51.3 82.3,53.08 80.39,53.08 80.04,53.43 80.04,66.26 v1(79.25,67.05)
  Bottom Layer w0.5: v1(73.91,68.57) 77.72,68.57 v1(79.25,67.05) ; v1(61.59,66.35) 61.34,66.6 61.34,72.76 ; v1(84.07,42.03) 84.07,40.95 R6.9
PA3: length 47.9
  Top Layer w0.254: R6.2 79.38,47.61 78.87,48.12 78.87,62.6 74.93,66.54 74.93,68.95 74.17,69.71 v1(67.06,69.71) ; 58.8,72.76 60.83,70.73 v1(62.87,70.73)
  Top Layer w0.5: H8.13 58.93,72.89 58.8,72.76
  Bottom Layer w0.254: v1(67.06,69.71) 65.28,69.71 64.26,70.73 v1(62.87,70.73)
PA4: length 67.2
  Top Layer w0.5: H8.12 56.26,77.71 56.26,72.63 52.2,68.57 26.16,68.57 21.72,64.12 11.18,64.12 4.44,57.39 4.44,53.58
PA5: length 71.7
  Top Layer w0.5: H8.11 53.85,72.89 53.72,72.76 ; NRF.5 6.98,47.87 7.11,47.74 12.09,47.74 14.1,49.75 14.1,53.2 19.3,58.41 24.89,58.41 28.83,62.35 44.07,62.35 45.34,63.62 51.82,63.62 53.59,65.39 v1(53.59,68.57)
  Bottom Layer w0.5: v1(53.59,68.57) 53.59,72.63 53.72,72.76
PA6: length 60.3
  Top Layer w0.5: v1(51.18,67.3) 48.77,64.89 45.09,64.89 43.81,63.62 28.32,63.62 24.26,59.55 17.53,59.55 12.45,54.47 12.45,52.19 11.3,51.04 NRF.7 ; H8.10 51.18,77.71 v1(51.18,69.59)
  Bottom Layer w0.5: v1(51.18,67.3) v1(51.18,69.59)
PA7: length 59.1
  Top Layer w0.5: v1(47.62,66.89) 27.53,66.89 22.99,62.35 13.08,62.35 6.98,56.25 NRF.6 ; v1(48.64,69.59) 48.64,77.71 H8.9
  Bottom Layer w0.5: v1(47.62,66.89) 48.64,67.91 v1(48.64,69.59)
PA8: length 69.9
  Top Layer w0.5: Type C端.5 H7.5
  Top Layer w0.8: 77.22,66.41 77.22,68.7 83.19,74.67 BUZZER1.1 ; 48.26,59.55 49.4,60.7 55.63,60.7 59.69,64.76 74.8,64.76
  Bottom Layer w0.8: Type C端.5 38.48,58.54 39.5,59.55 48.26,59.55 49.4,60.7 ; 73.28,64.76 75.56,64.76 77.22,66.41 77.22,67.43
  vias: v1(48.51,60.19) v1(48.51,59.56) v1(49.15,60.19) v1(49.15,59.56) v1(73.93,65.14) v1(73.93,64.51) v1(74.57,65.14) v1(74.57,64.51) v1(76.96,66.79) v1(76.96,66.16) v1(77.59,66.79) v1(77.59,66.16)
PA9: length 48.4
  Top Layer w0.5: Type C端.6 H7.6 41.02,49.52 37.47,45.96 v1(29.59,45.96) ; v1(23.24,40.76) 21.4,38.91 v1(8.89,38.91) ; 200.1 v1(6.35,38.91)
  Bottom Layer w0.5: v1(23.24,40.76) 28.45,45.96 v1(29.59,45.96) ; v1(6.35,38.91) v1(8.89,38.91)
PA10: length 70.9
  Top Layer w0.4: 200#3.1 97.78,38.08 97.54,37.84 93.73,37.84 v1(91.82,39.74) ; v1(44.07,45.08) 43.56,45.58 H7.7 ; v1(81.66,40.88) 85.47,40.88 86.23,41.65 v1(88.52,41.65) ; v1(63.37,41.01) 63.5,40.88 v1(73.79,40.88)
  Top Layer w0.5: Type C端.7 H7.7
  Bottom Layer w0.4: v1(88.52,41.65) 89.92,41.65 v1(91.82,39.74) ; v1(63.37,41.01) 61.21,43.17 55.88,43.17 53.97,45.08 v1(44.07,45.08) ; v1(81.66,40.88) v1(73.79,40.88)
PA11: length 57.7
  Top Layer w0.5: Type C端.8 H7.8 46.1,44.57 42.8,41.27 v1(31.24,41.27) ; v1(6.22,37.07) 6.16,37.07 200#2.1 ; v1(23.11,37.45) 22.73,37.07 v1(9.14,37.07)
  Bottom Layer w0.5: v1(6.22,37.07) v1(9.14,37.07) ; v1(31.24,41.27) 27.43,37.45 v1(23.11,37.45)
PA12: length 64.9
  Top Layer w0.254: 200#4.1 97.78,36.57 97.28,37.07 v1(93.22,37.07)
  Top Layer w0.5: Type C端.9 H7.9
  Bottom Layer w0.254: v1(93.22,37.07) 93.22,41.9 87.38,47.74 77.09,47.74 74.8,50.03 72.01,50.03 71.25,50.79 49.28,50.79 48.84,51.22 48.84,52.11 H7.9
PA15: length 5.2
  Top Layer w0.5: H7.10 Type C端.10
PB0: length 69.9
  Top Layer w0.5: 4.44,51.04 4.44,47.11 5.21,46.34 13.08,46.34 15.11,48.38 15.11,51.93 20.32,57.14 25.65,57.14 29.72,61.2 44.58,61.2 v1(45.97,62.6) ; H8.8 46.1,77.71 v1(46.1,69.46)
  Bottom Layer w0.5: v1(45.97,62.6) 46.1,62.73 v1(46.1,69.46)
PB1: length 52.5
  Top Layer w0.5: H8.7 43.56,77.71 v1(43.56,69.59) ; NRF.8 9.53,55.11 15.11,60.7 23.75,60.7 28.17,65.11 v1(43.56,65.11)
  Bottom Layer w0.5: v1(43.56,65.11) v1(43.56,69.59)
PB3: length 5.2
  Top Layer w0.5: Type C端.11 H7.11
PB4: length 5.2
  Top Layer w0.5: H7.12 Type C端.12
PB5: length 96
  Top Layer w0.5: SW1.1 6.48,8.13 6.48,5.96 8,4.44 11.18,4.44 12.45,5.71 12.45,18.41 14.99,20.94 26.29,20.94 41.66,36.31 50.16,36.31 58.8,44.95 H7.13 Type C端.13
PB6: length 122.1
  Top Layer w0.5: Type C端.14 H7.14 61.34,43.68 47.5,29.83 36.96,29.83 27.69,20.56 27.69,8.12 22.22,2.66 3.56,2.66 1.4,4.82 1.4,24.79 SW2.1
PB7: length 47.4
  Top Layer w0.5: v1(71.69,49.2) 74.8,46.09 74.8,42.53 81.28,36.06 v1(82.55,36.06) ; SW3.1 90.6,29.02 86.11,33.52 v1(85.22,33.52) ; v1(63.88,49.39) H7.15 Type C端.15
  Bottom Layer w0.5: v1(85.22,33.52) 82.68,36.06 v1(82.55,36.06) ; v1(71.69,49.2) 64.07,49.2 v1(63.88,49.39)
PB8: length 28.2
  Top Layer w0.5: v1(56.26,44.31) 54.23,44.31 52.83,45.71 U2.3 ; Type C端.16 H7.16 66.42,46.73 v1(64.64,44.95)
  Bottom Layer w0.5: v1(64.64,44.95) 64.01,44.31 v1(56.26,44.31)
PB9: length 30.6
  Top Layer w0.5: v1(56.77,46.09) 55.37,47.49 U2.4 ; v1(62.61,46.09) 63.25,45.46 63.25,43.3 63.6,42.94 66.83,42.94 68.96,45.08 H7.17 Type C端.17
  Bottom Layer w0.5: v1(56.77,46.09) v1(62.61,46.09)
PB10: length 5.1
  Top Layer w0.5: 41.02,72.76 41.02,77.71 H8.6
PB11: length 5.1
  Top Layer w0.5: 38.48,72.76 38.48,77.71 H8.5
PB12: length 42.9
  Top Layer w0.4: v1(27.24,49.46) 26.84,49.06 26.84,32.46 28.07,31.23 28.07,25.77 R5.14
  Top Layer w0.5: R5.13 R5.14 ; H7.1 Type C端.1
  Bottom Layer w0.4: v1(27.24,49.46) 28.32,50.54 H7.1
PB13: length 78.6
  Top Layer w0.5: v1(36.96,34.15) v1(36.96,37.71) ; v1(36.19,42.92) v1(34.42,44.69) ; 82.93,23.74 R6.13 ; Type C端.2 H7.2 ; v1(69.98,26.03) 40.89,26.03 v1(39.62,27.3)
  Bottom Layer w0.5: R6.13 73.53,26.03 v1(69.98,26.03) ; v1(39.62,27.3) 36.96,29.96 v1(36.96,34.15) ; v1(36.96,37.71) 36.96,42.15 v1(36.19,42.92) ; v1(34.42,44.69) 30.86,48.25 H7.2
PB14: length 88.6
  Top Layer w0.5: v1(70.1,14.98) 74.08,11 SW4.1 ; H7.3 Type C端.3
  Bottom Layer w0.5: H7.3 33.4,51.68 40.64,44.44 40.64,29.58 46.74,23.48 61.59,23.48 v1(70.1,14.98)
PB15: length 67.2
  Top Layer w0.5: H7.4 Type C端.4 ; v1(83.44,54.47) 93.23,54.47 95.48,52.22 LED5.4
  Bottom Layer w0.5: v1(83.44,54.47) 38.99,54.47 Type C端.4
PC13: length 5.1
  Top Layer w0.5: 74.04,72.76 74.04,77.71 H8.19
PC14: length 5.1
  Top Layer w0.5: H8.18 71.5,77.71 71.5,72.76
PC15: length 5.1
  Top Layer w0.5: 68.96,72.76 68.96,77.71 H8.17
RES: length 5.1
  Top Layer w0.5: H8.4 35.94,77.71 35.94,72.76
V+: length 10.1
  Top Layer w1: IN+.1 33.44,19.51 IN+#2.1
V-: length 10
  Top Layer w1: IN-#2.1 33.65,1.48 IN-.1
$1N3007: length 3.1
  Top Layer w0.5: 3.46,38.91 3.46,41.97 LED1.1
$1N3213: length 3.2
  Top Layer w0.5: 3.46,35.88 3.52,35.82 LED2.1
$1N3298: length 3.1
  Top Layer w0.5: 200#3.2 96.22,38.96 LED3.1
$1N3383: length 3.1
  Top Layer w0.5: 200#4.2 96.22,35.83 LED4.1
$1N3608: length 7
  Top Layer w0.5: LED6.4 86.57,56.67 86.88,56.97 LED5.2
$1N3616: length 15.1
  Top Layer w0.5: LED6.2 82.57,61.92 84.78,64.12 93.48,64.12 95.48,62.13 LED7.4
$1N3624: length 6.9
  Top Layer w0.5: LED7.2 91.48,66.88 91.43,66.83 LED8.4

## Copper pours and planes (outline as drawn; the poured copper is in the pictures)
3V3 on Top Layer: 4.56,33.96 6.86,33.96 6.86,31.49 4.56,31.49
3V3 on Top Layer: 35.05,12.56 39.12,12.56 39.12,8.63 35.05,8.63
3V3 on Top Layer: 89.71,39.33 89.68,39.51 89.63,39.69 89.54,39.86 89.43,40.01 89.3,40.14 89.14,40.25 88.98,40.34 88.8,40.4 88.61,40.43 88.43,40.43 88.24,40.4 88.06,40.34 87.89,40.25 87.74,40.14 87.61,40.01 87.5,39.86 87.41,39.69 87.35,39.51 87.32,39.33 87.32,39.14 87.35,38.95 87.41,38.77 87.5,38.61 87.61,38.45 87.74,38.32 87.89,38.21 88.06,38.13 88.24,38.07 88.43,38.04 88.61,38.04 88.8,38.07 88.98,38.13 89.14,38.21 89.3,38.32 89.43,38.45 89.54,38.61 89.63,38.77 89.68,38.95 89.71,39.14
3V3 on Top Layer: 4.83,43.04 8.13,43.04 8.13,40.5 4.83,40.5
3V3 on Top Layer: 8.06,24.55 12.45,24.55 12.45,20.18 8.06,20.18
3V3 on Top Layer: 26.14,41.08 26.11,41.23 26.05,41.36 25.97,41.48 25.87,41.58 25.75,41.66 25.61,41.72 25.47,41.75 25.33,41.75 25.19,41.72 25.05,41.66 24.93,41.58 24.83,41.48 24.75,41.36 24.69,41.23 24.66,41.08 24.66,40.94 24.69,40.8 24.75,40.66 24.83,40.54 24.93,40.44 25.05,40.36 25.19,40.3 25.33,40.27 25.47,40.27 25.61,40.3 25.75,40.36 25.87,40.44 25.97,40.54 26.05,40.66 26.11,40.8 26.14,40.94
3V3 on Top Layer: 11.94,22.63 11.91,22.86 11.85,23.1 11.76,23.32 11.64,23.53 11.49,23.72 11.32,23.89 11.13,24.03 10.92,24.15 10.7,24.25 10.47,24.31 10.23,24.34 9.99,24.34 9.75,24.31 9.52,24.25 9.29,24.15 9.09,24.03 8.9,23.89 8.72,23.72 8.58,23.53 8.46,23.32 8.37,23.1 8.3,22.86 8.27,22.63 8.27,22.38 8.3,22.15 8.37,21.91 8.46,21.69 8.58,21.48 8.72,21.29 8.9,21.12 9.09,20.98 9.29,20.86 9.52,20.76 9.75,20.7 9.99,20.67 10.23,20.67 10.47,20.7 10.7,20.76 10.92,20.86 11.13,20.98 11.32,21.12 11.49,21.29 11.64,21.48 11.76,21.69 11.85,21.91 11.91,22.15 11.94,22.38
3V3 on Bottom Layer: 8.05,24.57 12.45,24.57 12.45,20.18 8.05,20.18
3V3 on Bottom Layer: 35.05,12.56 39.12,12.56 39.12,8.63 35.05,8.63
3V3 on Bottom Layer: 4.83,43.17 8.13,43.17 8.13,40.63 4.83,40.63
3V3 on Bottom Layer: 26.08,41.08 26.05,41.21 26,41.33 25.92,41.44 25.83,41.54 25.72,41.61 25.6,41.66 25.47,41.69 25.33,41.69 25.2,41.66 25.08,41.61 24.97,41.54 24.88,41.44 24.8,41.33 24.75,41.21 24.72,41.08 24.72,40.94 24.75,40.81 24.8,40.69 24.88,40.58 24.97,40.49 25.08,40.41 25.2,40.36 25.33,40.34 25.47,40.34 25.6,40.36 25.72,40.41 25.83,40.49 25.92,40.58 26,40.69 26.05,40.81 26.08,40.94
5V on Bottom Layer: 84.58,72.63 86.57,72.63 86.57,70.74 84.58,70.74
5V on Bottom Layer: 81.31,51.5 82.68,51.5 82.68,49.9 81.31,49.9
GND on Top Layer: -20.19,124.83 156.46,124.83 156.46,-47.13 -20.19,-47.13
GND on Bottom Layer: -43.31,134.61 125.73,134.61 125.73,-51.83 -43.31,-51.83
PA8 on Top Layer: 76.45,67.15 78.1,67.15 78.1,65.78 76.45,65.78
PA8 on Top Layer: 73.41,65.65 75.06,65.65 75.06,63.87 73.41,63.87
PA8 on Top Layer: 48.01,60.57 49.78,60.57 49.78,59.05 48.01,59.05
PA8 on Bottom Layer: 48.01,60.57 49.78,60.57 49.78,59.05 48.01,59.05
PA8 on Bottom Layer: 76.58,67.17 78.1,67.17 78.1,65.78 76.58,65.78
PA8 on Bottom Layer: 73.41,65.65 75.18,65.65 75.18,63.87 73.41,63.87

Small or netless copper shapes (teardrops, artwork), in the pictures only: 269 on Top Layer, 79 on Bottom Layer

## Text on the board
Bottom Silkscreen Layer: 通讯：PA4,5,6,7,PB0,1 / 摇杆：PA0,1,2,3 / 摇杆按键：PB12,13 / OLED:PB8,9 / 蜂鸣器：PA8 / 蓝牙：PA9,10 / LED:PA9,10,11,12 / WS281B:PB15 / 按键：PB5,6,7,14
Top Silkscreen Layer: PB6 | PB5 | 220uf | PB12 | PB13 | PB7 | PB14 | PA0 | GND | VCC | SCL | SDA | PA3 | 3V3 | 5V | PA1 | PA2 | 下载端
